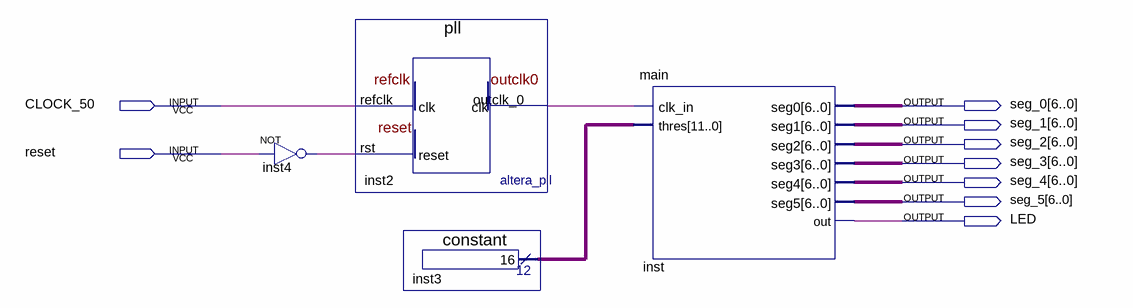
[diagram p0: schematic sheet]
// Quartus schematic Energy_Sensing.bdf as structural Verilog: 4 symbols, 9 pins
module Energy_Sensing (
  input  CLOCK_50,
  input  reset,
  output [6:0] seg_0,
  output [6:0] seg_1,
  output [6:0] seg_2,
  output [6:0] seg_3,
  output [6:0] seg_4,
  output [6:0] seg_5,
  output LED
);

  wire inst2_outclk_0, inst4_out;
  wire [11:0] inst3_result;

  not inst4 (inst4_out, reset);
  pll inst2 (.refclk(CLOCK_50), .rst(inst4_out), .outclk_0(inst2_outclk_0));
  constant inst3 (.result(inst3_result));
  main inst (
    .clk_in(inst2_outclk_0), .thres(inst3_result), .seg0(seg_0), .seg1(seg_1), .seg2(seg_2), .seg3(seg_3),
    .seg4(seg_4), .seg5(seg_5), .out(LED));
endmodule
